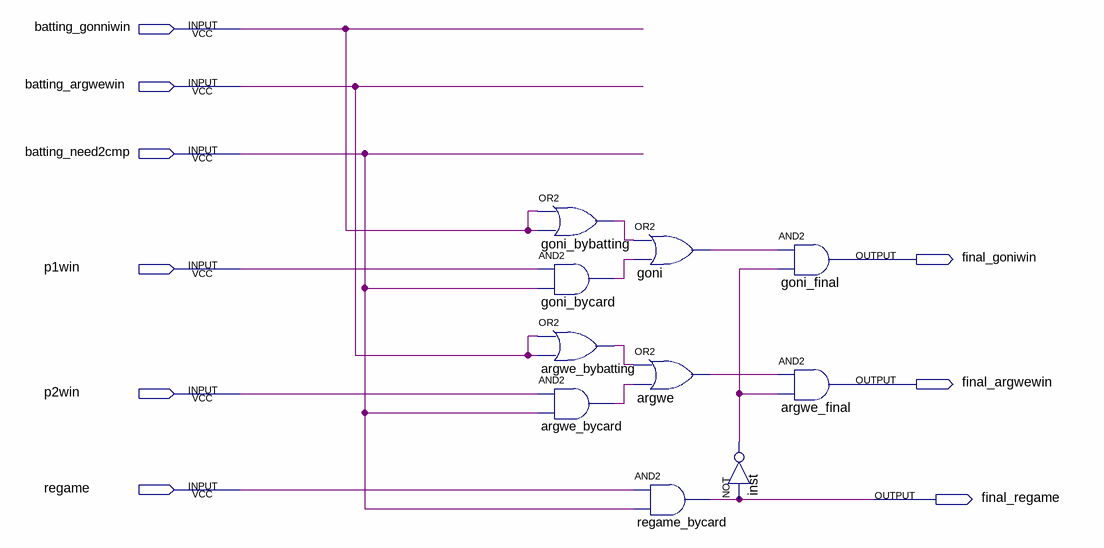
[diagram p0: schematic sheet]
// Quartus schematic selectfinalwinner.bdf as structural Verilog: 10 symbols, 9 pins
module selectfinalwinner (
  input  batting_gonniwin,
  input  batting_argwewin,
  input  batting_need2cmp,
  input  p1win,
  input  p2win,
  input  regame,
  output final_goniwin,
  output final_argwewin,
  output final_regame
);

  wire argwe_bybatting_out, argwe_bycard_out, argwe_out, goni_bybatting_out, goni_bycard_out, goni_out,
       inst_out;

  or goni_bybatting (goni_bybatting_out, batting_gonniwin, batting_gonniwin);
  and goni_bycard (goni_bycard_out, p1win, batting_need2cmp);
  or argwe_bybatting (argwe_bybatting_out, batting_argwewin, batting_argwewin);
  and argwe_bycard (argwe_bycard_out, p2win, batting_need2cmp);
  or goni (goni_out, goni_bybatting_out, goni_bycard_out);
  or argwe (argwe_out, argwe_bybatting_out, argwe_bycard_out);
  and regame_bycard (final_regame, regame, batting_need2cmp);
  not inst (inst_out, final_regame);
  and goni_final (final_goniwin, goni_out, inst_out);
  and argwe_final (final_argwewin, argwe_out, inst_out);
endmodule
